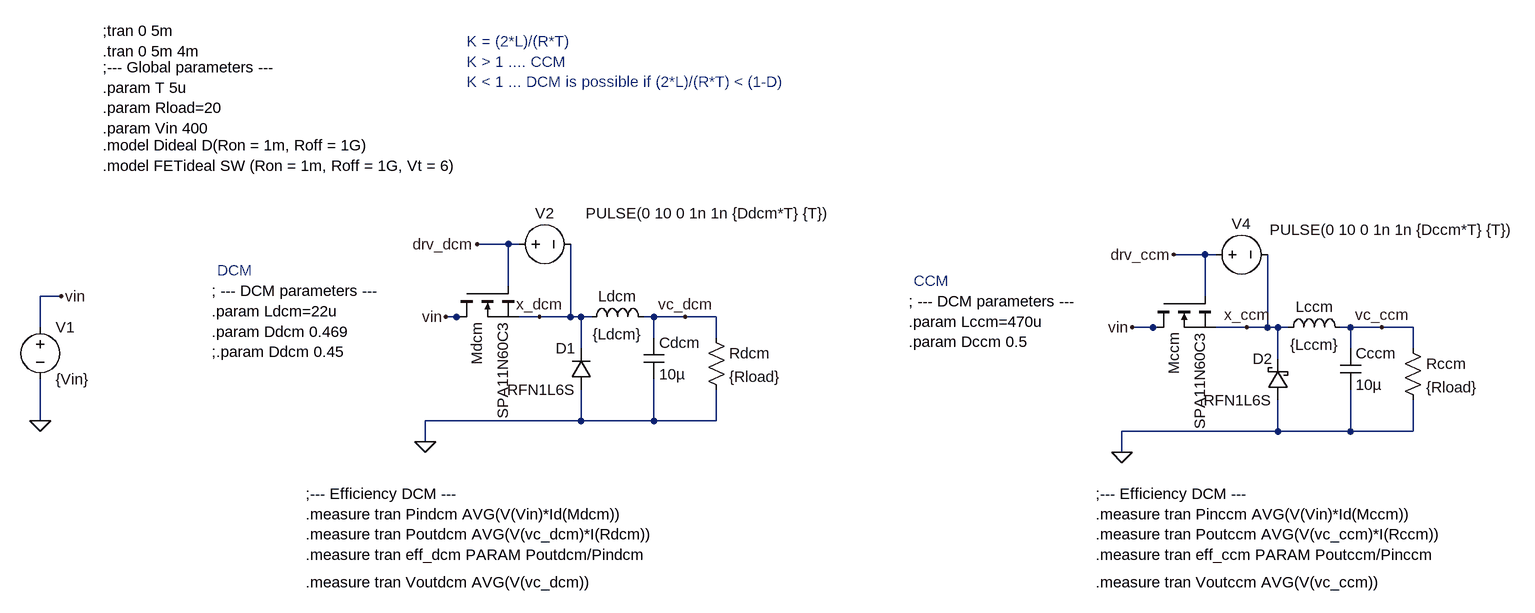
[diagram p0: schematic DCM_buck_vs_CCM_buck.asc]
DCM_buck_vs_CCM_buck.asc, the LTspice schematic file:
Version 4
SHEET 1 1764 680
WIRE 192 -32 144 -32
WIRE 208 -32 192 -32
WIRE 1264 -16 1216 -16
WIRE 1280 -16 1264 -16
WIRE 192 32 192 -32
WIRE -496 48 -528 48
WIRE 1264 48 1264 -16
WIRE 112 80 96 80
WIRE 128 80 112 80
WIRE 240 80 208 80
WIRE 288 80 288 -32
WIRE 288 80 240 80
WIRE 304 80 288 80
WIRE 320 80 304 80
WIRE 416 80 400 80
WIRE 464 80 416 80
WIRE 512 80 464 80
WIRE -528 96 -528 48
WIRE 1184 96 1152 96
WIRE 1200 96 1184 96
WIRE 1328 96 1280 96
WIRE 1360 96 1360 -16
WIRE 1360 96 1328 96
WIRE 1376 96 1360 96
WIRE 1392 96 1376 96
WIRE 1488 96 1472 96
WIRE 1536 96 1488 96
WIRE 1584 96 1536 96
WIRE 416 112 416 80
WIRE 512 112 512 80
WIRE 304 128 304 80
WIRE 1488 128 1488 96
WIRE 1584 128 1584 96
WIRE 1376 144 1376 96
WIRE -528 240 -528 176
WIRE 304 240 304 192
WIRE 304 240 64 240
WIRE 416 240 416 176
WIRE 416 240 304 240
WIRE 512 240 512 192
WIRE 512 240 416 240
WIRE 1376 256 1376 208
WIRE 1376 256 1136 256
WIRE 1488 256 1488 192
WIRE 1488 256 1376 256
WIRE 1584 256 1584 208
WIRE 1584 256 1488 256
WIRE 64 272 64 240
WIRE 1136 288 1136 256
FLAG -528 240 0
FLAG 464 80 vc_dcm
FLAG -496 48 vin
FLAG 1136 288 0
FLAG 1536 96 vc_ccm
FLAG 1152 96 vin
FLAG 96 80 vin
FLAG 64 272 0
FLAG 144 -32 drv_dcm
FLAG 1216 -16 drv_ccm
FLAG 1328 96 x_ccm
FLAG 240 80 x_dcm
SYMBOL voltage -528 80 R0
SYMATTR InstName V1
SYMATTR Value {Vin}
SYMBOL diode 320 192 R180
WINDOW 0 24 64 Left 2
WINDOW 3 24 0 Left 2
SYMATTR InstName D1
SYMATTR Value RFN1L6S
SYMBOL cap 400 112 R0
SYMATTR InstName Cdcm
SYMATTR Value 10µ
SYMBOL res 496 96 R0
SYMATTR InstName Rdcm
SYMATTR Value {Rload}
SYMBOL voltage 192 -32 R270
WINDOW 0 32 56 VTop 2
WINDOW 3 63 308 VBottom 2
WINDOW 123 0 0 Left 2
WINDOW 39 4 56 VTop 2
SYMATTR InstName V2
SYMATTR Value PULSE(0 10 0 1n 1n {Ddcm*T} {T})
SYMBOL ind 304 96 R270
WINDOW 0 32 56 VTop 2
WINDOW 3 5 56 VBottom 2
SYMATTR InstName Ldcm
SYMATTR Value {Ldcm}
SYMBOL schottky 1392 208 R180
WINDOW 0 24 64 Left 2
WINDOW 3 24 0 Left 2
SYMATTR InstName D2
SYMATTR Value RFN1L6S
SYMATTR Description Diode
SYMATTR Type diode
SYMBOL cap 1472 128 R0
SYMATTR InstName Cccm
SYMATTR Value 10µ
SYMBOL res 1568 112 R0
SYMATTR InstName Rccm
SYMATTR Value {Rload}
SYMBOL voltage 1264 -16 R270
WINDOW 0 32 56 VTop 2
WINDOW 3 54 288 VBottom 2
WINDOW 123 0 0 Left 2
WINDOW 39 4 56 VTop 2
SYMATTR InstName V4
SYMATTR Value PULSE(0 10 0 1n 1n {Dccm*T} {T})
SYMBOL ind 1376 112 R270
WINDOW 0 32 56 VTop 2
WINDOW 3 5 56 VBottom 2
SYMATTR InstName Lccm
SYMATTR Value {Lccm}
SYMBOL nmos 112 32 M90
SYMATTR InstName Mdcm
SYMATTR Value SPA11N60C3
SYMBOL nmos 1184 48 M90
SYMATTR InstName Mccm
SYMATTR Value SPA11N60C3
TEXT -432 -360 Left 2 !;tran 0 5m\n.tran 0 5m 4m
TEXT -432 -184 Left 2 !.model Dideal D(Ron = 1m, Roff = 1G)\n.model FETideal SW (Ron = 1m, Roff = 1G, Vt = 6)
TEXT 128 -344 Left 2 ;K = (2*L)/(R*T)\nK > 1 .... CCM\nK < 1 ... DCM is possible if (2*L)/(R*T) < (1-D)
TEXT -256 8 Left 2 ;DCM
TEXT -432 -304 Left 2 !;--- Global parameters ---\n.param T 5u\n.param Rload=20\n.param Vin 400
TEXT -264 40 Left 2 !; --- DCM parameters ---\n.param Ldcm=22u\n.param Ddcm 0.469\n;.param Ddcm 0.45
TEXT 816 24 Left 2 ;CCM
TEXT 808 56 Left 2 !; --- DCM parameters ---\n.param Lccm=470u\n.param Dccm 0.5
TEXT -120 352 Left 2 !;--- Efficiency DCM ---\n.measure tran Pindcm AVG(V(Vin)*Id(Mdcm))\n.measure tran Poutdcm AVG(V(vc_dcm)*I(Rdcm))\n.measure tran eff_dcm PARAM Poutdcm/Pindcm
TEXT 1096 352 Left 2 !;--- Efficiency DCM ---\n.measure tran Pinccm AVG(V(Vin)*Id(Mccm))\n.measure tran Poutccm AVG(V(vc_ccm)*I(Rccm))\n.measure tran eff_ccm PARAM Poutccm/Pinccm
TEXT -120 488 Left 2 !.measure tran Voutdcm AVG(V(vc_dcm))
TEXT 1096 488 Left 2 !.measure tran Voutccm AVG(V(vc_ccm))

The netlist it stands for:
* DCM_buck_vs_CCM_buck.asc
V1 vin 0 {Vin}
D1 0 x_dcm RFN1L6S
Cdcm vc_dcm 0 10µ
Rdcm vc_dcm 0 {Rload}
V2 drv_dcm x_dcm PULSE(0 10 0 1n 1n {Ddcm*T} {T})
Ldcm x_dcm vc_dcm {Ldcm}
D2 0 x_ccm RFN1L6S
Cccm vc_ccm 0 10µ
Rccm vc_ccm 0 {Rload}
V4 drv_ccm x_ccm PULSE(0 10 0 1n 1n {Dccm*T} {T})
Lccm x_ccm vc_ccm {Lccm}
Mdcm vin drv_dcm x_dcm x_dcm SPA11N60C3
Mccm vin drv_ccm x_ccm x_ccm SPA11N60C3
.model D D
.lib standard.dio
.model NMOS NMOS
.model PMOS PMOS
.lib standard.mos
;tran 0 5m
.tran 0 5m 4m
.model Dideal D(Ron = 1m, Roff = 1G)
.model FETideal SW (Ron = 1m, Roff = 1G, Vt = 6)
* K = (2*L)/(R*T)
* K > 1 .... CCM
* K < 1 ... DCM is possible if (2*L)/(R*T) < (1-D)
* DCM
;--- Global parameters ---
.param T 5u
.param Rload=20
.param Vin 400
; --- DCM parameters ---
.param Ldcm=22u
.param Ddcm 0.469
;.param Ddcm 0.45
* CCM
; --- DCM parameters ---
.param Lccm=470u
.param Dccm 0.5
;--- Efficiency DCM ---
.measure tran Pindcm AVG(V(Vin)*Id(Mdcm))
.measure tran Poutdcm AVG(V(vc_dcm)*I(Rdcm))
.measure tran eff_dcm PARAM Poutdcm/Pindcm
;--- Efficiency DCM ---
.measure tran Pinccm AVG(V(Vin)*Id(Mccm))
.measure tran Poutccm AVG(V(vc_ccm)*I(Rccm))
.measure tran eff_ccm PARAM Poutccm/Pinccm
.measure tran Voutdcm AVG(V(vc_dcm))
.measure tran Voutccm AVG(V(vc_ccm))
.backanno
.end